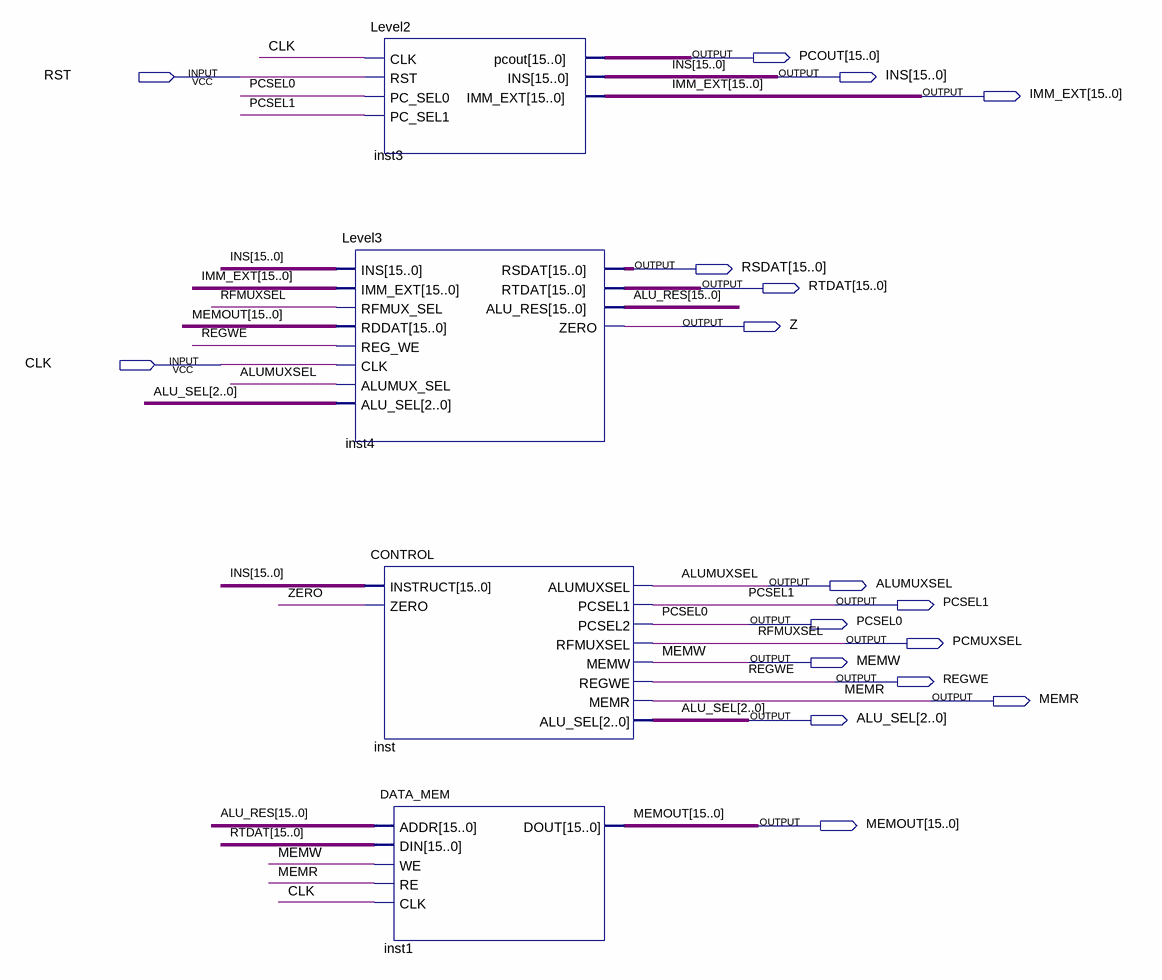
[diagram p0: schematic sheet]
// Quartus schematic topLev.bdf as structural Verilog: 4 symbols, 17 pins
module topLev (
  input  RST,
  input  CLK,
  output [15:0] PCOUT,
  output [15:0] INS,
  output [15:0] IMM_EXT,
  output [15:0] RSDAT,
  output [15:0] RTDAT,
  output Z,
  output ALUMUXSEL,
  output PCSEL1,
  output PCSEL0,
  output PCMUXSEL,
  output MEMW,
  output REGWE,
  output MEMR,
  output [2:0] ALU_SEL,
  output [15:0] MEMOUT
);

  wire ZERO;
  wire [15:0] ALU_RES;

  Level2 inst3 (.CLK(CLK), .RST(RST), .PC_SEL0(PCSEL0), .PC_SEL1(PCSEL1), .pcout(PCOUT), .INS(INS), .IMM_EXT(IMM_EXT));
  Level3 inst4 (
    .INS(INS), .IMM_EXT(IMM_EXT), .RFMUX_SEL(PCMUXSEL), .RDDAT(MEMOUT), .REG_WE(REGWE), .CLK(CLK),
    .ALUMUX_SEL(ALUMUXSEL), .ALU_SEL(ALU_SEL), .RSDAT(RSDAT), .RTDAT(RTDAT), .ALU_RES(ALU_RES), .ZERO(Z));
  CONTROL inst (
    .INSTRUCT(INS), .ZERO(ZERO), .ALUMUXSEL(ALUMUXSEL), .PCSEL1(PCSEL1), .PCSEL2(PCSEL0),
    .RFMUXSEL(PCMUXSEL), .MEMW(MEMW), .REGWE(REGWE), .MEMR(MEMR), .ALU_SEL(ALU_SEL));
  DATA_MEM inst1 (.ADDR(ALU_RES), .DIN(RTDAT), .WE(MEMW), .RE(MEMR), .CLK(CLK), .DOUT(MEMOUT));

  // Other names for the same wires on the sheet: RFMUXSEL = PCMUXSEL
endmodule
